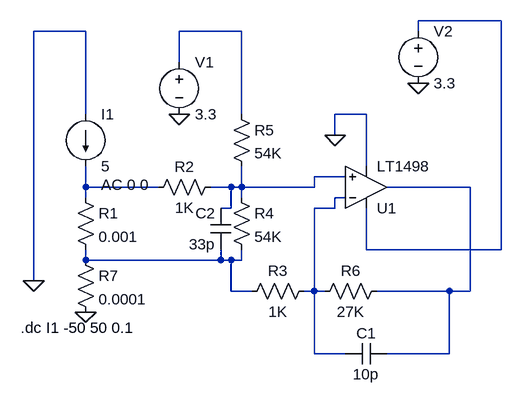
[diagram p0: schematic current_amplifier.asc]
current_amplifier.asc, the LTspice schematic file:
Version 4
SHEET 1 1260 680
WIRE 752 -112 624 -112
WIRE 112 -96 32 -96
WIRE 352 -96 256 -96
WIRE 624 -96 624 -112
WIRE 256 -48 256 -96
WIRE 112 32 112 -96
WIRE 352 32 352 -96
WIRE 544 32 496 32
WIRE 496 64 496 32
WIRE 544 112 544 32
WIRE 512 128 464 128
WIRE 112 144 112 112
WIRE 224 144 112 144
WIRE 336 144 304 144
WIRE 352 144 352 112
WIRE 352 144 336 144
WIRE 464 144 464 128
WIRE 464 144 352 144
WIRE 704 144 576 144
WIRE 112 160 112 144
WIRE 352 160 352 144
WIRE 512 160 496 160
WIRE 336 176 336 144
WIRE 336 176 320 176
WIRE 496 176 496 160
WIRE 496 176 464 176
WIRE 544 240 544 176
WIRE 752 240 752 -112
WIRE 752 240 544 240
WIRE 112 256 112 240
WIRE 320 256 320 240
WIRE 320 256 112 256
WIRE 336 256 320 256
WIRE 352 256 352 240
WIRE 352 256 336 256
WIRE 32 288 32 -96
WIRE 336 304 336 256
WIRE 368 304 336 304
WIRE 464 304 464 176
WIRE 464 304 448 304
WIRE 480 304 464 304
WIRE 672 304 560 304
WIRE 704 304 704 144
WIRE 704 304 672 304
WIRE 464 400 464 304
WIRE 512 400 464 400
WIRE 672 400 672 304
WIRE 672 400 576 400
FLAG 112 336 0
FLAG 32 288 0
FLAG 256 32 0
FLAG 496 64 0
FLAG 624 -16 0
SYMBOL res 96 144 R0
SYMATTR InstName R1
SYMATTR Value 0.001
SYMBOL current 112 32 R0
WINDOW 123 24 108 Left 2
WINDOW 39 0 0 Left 0
SYMATTR InstName I1
SYMATTR Value 5
SYMATTR Value2 AC 0 0
SYMBOL res 320 128 R90
WINDOW 0 0 56 VBottom 2
WINDOW 3 32 56 VTop 2
SYMATTR InstName R2
SYMATTR Value 1K
SYMBOL res 336 144 R0
SYMATTR InstName R4
SYMATTR Value 54K
SYMBOL res 336 16 R0
SYMATTR InstName R5
SYMATTR Value 54K
SYMBOL voltage 256 -64 R0
WINDOW 123 0 0 Left 0
WINDOW 39 0 0 Left 0
SYMATTR InstName V1
SYMATTR Value 3.3
SYMBOL res 576 288 R90
WINDOW 0 0 56 VBottom 2
WINDOW 3 32 56 VTop 2
SYMATTR InstName R6
SYMATTR Value 27K
SYMBOL voltage 624 -112 R0
WINDOW 123 0 0 Left 0
WINDOW 39 0 0 Left 0
SYMATTR InstName V2
SYMATTR Value 3.3
SYMBOL Opamps\\LT1498 544 208 M180
SYMATTR InstName U1
SYMBOL res 464 288 R90
WINDOW 0 0 56 VBottom 2
WINDOW 3 32 56 VTop 2
SYMATTR InstName R3
SYMATTR Value 1K
SYMBOL res 96 240 R0
SYMATTR InstName R7
SYMATTR Value 0.0001
SYMBOL cap 576 384 R90
WINDOW 0 0 32 VBottom 2
WINDOW 3 32 32 VTop 2
SYMATTR InstName C1
SYMATTR Value 10p
SYMBOL cap 336 240 R180
WINDOW 0 24 56 Left 2
WINDOW 3 24 8 Left 2
SYMATTR InstName C2
SYMATTR Value 33p
TEXT 12 360 Left 2 !.dc I1 -50 50 0.1

The netlist it stands for:
* current_amplifier.asc
R1 N004 N007 0.001
I1 0 N004 5 AC 0 0
R2 N003 N004 1K
R4 N003 N007 54K
R5 N002 N003 54K
V1 N002 0 3.3
R6 N005 N006 27K
V2 N001 0 3.3
XU1 N003 N006 N001 0 N005 LT1498  ; pins In+ In- V+ V- OUT
R3 N006 N007 1K
R7 N007 0 0.0001
C1 N005 N006 10p
C2 N007 N003 33p
.dc I1 -50 50 0.1
.lib LTC.lib
.backanno
.end